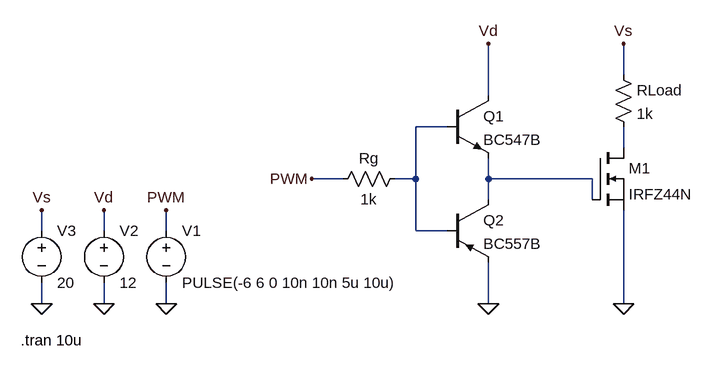
[diagram p0: schematic Totem-Pole Driving.asc]
Totem-Pole Driving.asc, the LTspice schematic file:
Version 4
SHEET 1 880 680
WIRE 416 0 416 -48
WIRE 208 32 208 -48
WIRE 144 80 96 80
WIRE 416 112 416 80
WIRE -16 160 -64 160
WIRE 96 160 96 80
WIRE 96 160 64 160
WIRE 208 160 208 128
WIRE 368 160 208 160
WIRE 208 192 208 160
WIRE 368 192 368 160
WIRE -480 240 -480 208
WIRE -384 240 -384 208
WIRE -288 240 -288 208
WIRE 96 240 96 160
WIRE 144 240 96 240
WIRE -480 352 -480 320
WIRE -384 352 -384 320
WIRE -288 352 -288 320
WIRE 208 352 208 288
WIRE 416 352 416 208
FLAG 208 352 0
FLAG 416 352 0
FLAG 416 -48 Vs
FLAG 208 -48 Vd
FLAG -64 160 PWM
FLAG -288 352 0
FLAG -384 352 0
FLAG -480 352 0
FLAG -288 208 PWM
FLAG -384 208 Vd
FLAG -480 208 Vs
SYMBOL npn 144 32 R0
SYMATTR InstName Q1
SYMATTR Value BC547B
SYMBOL pnp 144 192 R0
SYMATTR InstName Q2
SYMATTR Value BC557B
SYMBOL res 80 144 R90
WINDOW 0 0 56 VBottom 2
WINDOW 3 32 56 VTop 2
SYMATTR InstName Rg
SYMATTR Value 1k
SYMBOL nmos 368 112 R0
SYMATTR InstName M1
SYMATTR Value IRFZ44N
SYMBOL res 400 -16 R0
SYMATTR InstName RLoad
SYMATTR Value 1k
SYMBOL voltage -288 224 R0
WINDOW 123 0 0 Left 0
WINDOW 39 0 0 Left 0
SYMATTR InstName V1
SYMATTR Value PULSE(-6 6 0 10n 10n 5u 10u)
SYMBOL voltage -384 224 R0
WINDOW 123 0 0 Left 0
WINDOW 39 0 0 Left 0
SYMATTR InstName V2
SYMATTR Value 12
SYMBOL voltage -480 224 R0
WINDOW 123 0 0 Left 0
WINDOW 39 0 0 Left 0
SYMATTR InstName V3
SYMATTR Value 20
TEXT -512 408 Left 2 !.tran 10u

The netlist it stands for:
* Totem-Pole Driving.asc
Q1 Vd N001 N003 0 BC547B
Q2 N003 N001 0 0 BC557B
Rg N001 PWM 1k
M1 N002 N003 0 0 IRFZ44N
RLoad Vs N002 1k
V1 PWM 0 PULSE(-6 6 0 10n 10n 5u 10u)
V2 Vd 0 12
V3 Vs 0 20
.model NPN NPN
.model PNP PNP
.lib standard.bjt
.model NMOS NMOS
.model PMOS PMOS
.lib standard.mos
.tran 10u
.backanno
.end